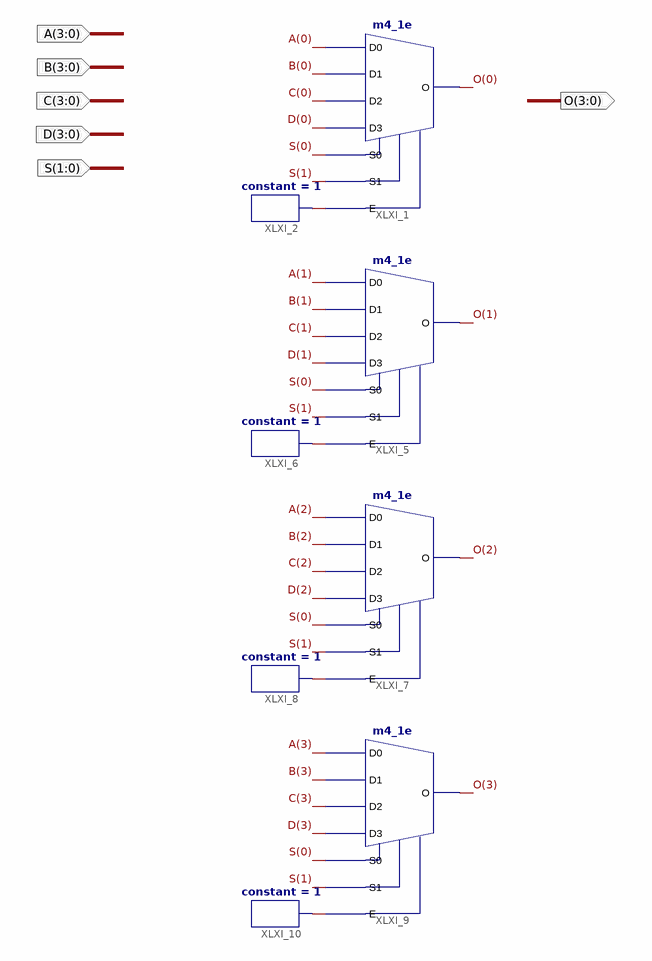
[diagram p0: schematic sheet 1]
// Xilinx ISE schematic mux4b4.sch (spartan3e) as structural Verilog: 8 symbols, 6 ports
module mux4b4 (
  input  [3:0] A,
  input  [3:0] B,
  input  [3:0] C,
  input  [3:0] D,
  input  [1:0] S,
  output [3:0] O
);

  wire XLXN_1, XLXN_24, XLXN_32, XLXN_40;

  m4_1e XLXI_1 (.D0(A[0]), .D1(B[0]), .D2(C[0]), .D3(D[0]), .E(XLXN_1), .S0(S[0]), .S1(S[1]), .O(O[0]));
  constant #(.CValue("1")) XLXI_2 (.O(XLXN_1));
  m4_1e XLXI_5 (.D0(A[1]), .D1(B[1]), .D2(C[1]), .D3(D[1]), .E(XLXN_24), .S0(S[0]), .S1(S[1]), .O(O[1]));
  constant #(.CValue("1")) XLXI_6 (.O(XLXN_24));
  m4_1e XLXI_7 (.D0(A[2]), .D1(B[2]), .D2(C[2]), .D3(D[2]), .E(XLXN_32), .S0(S[0]), .S1(S[1]), .O(O[2]));
  constant #(.CValue("1")) XLXI_8 (.O(XLXN_32));
  m4_1e XLXI_9 (.D0(A[3]), .D1(B[3]), .D2(C[3]), .D3(D[3]), .E(XLXN_40), .S0(S[0]), .S1(S[1]), .O(O[3]));
  constant #(.CValue("1")) XLXI_10 (.O(XLXN_40));
endmodule
